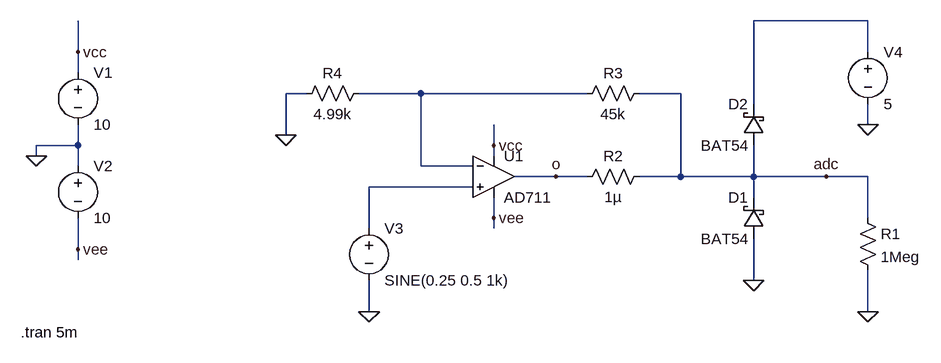
[diagram p0: schematic DAQ Device Op Amp Clamp Protection Mistake.asc]
DAQ Device Op Amp Clamp Protection Mistake.asc, the LTspice schematic file:
Version 4
SHEET 1 880 680
WIRE 672 -112 496 -112
WIRE -544 -64 -544 -112
WIRE 672 -64 672 -112
WIRE -544 -32 -544 -64
WIRE -192 0 -224 0
WIRE -16 0 -112 0
WIRE 240 0 -16 0
WIRE 384 0 320 0
WIRE 496 16 496 -112
WIRE 672 48 672 16
WIRE -224 64 -224 0
WIRE -544 80 -544 48
WIRE -544 80 -608 80
WIRE 96 80 96 48
WIRE -608 96 -608 80
WIRE 96 96 96 80
WIRE -544 112 -544 80
WIRE -16 112 -16 0
WIRE 64 112 -16 112
WIRE 192 128 128 128
WIRE 240 128 192 128
WIRE 384 128 384 0
WIRE 384 128 320 128
WIRE 496 128 496 80
WIRE 496 128 384 128
WIRE 608 128 496 128
WIRE 672 128 608 128
WIRE 64 144 -96 144
WIRE 496 160 496 128
WIRE 96 192 96 160
WIRE 672 192 672 128
WIRE -96 208 -96 144
WIRE 96 208 96 192
WIRE -544 240 -544 192
WIRE -544 256 -544 240
WIRE 496 288 496 224
WIRE -96 336 -96 288
WIRE 672 336 672 272
FLAG -608 96 0
FLAG -96 336 0
FLAG 672 336 0
FLAG -224 64 0
FLAG 96 80 vcc
FLAG -544 -64 vcc
FLAG -544 240 vee
FLAG 96 192 vee
FLAG 496 288 0
FLAG 672 48 0
FLAG 608 128 adc
FLAG 192 128 o
SYMBOL OpAmps\\AD711 96 64 R0
SYMATTR InstName U1
SYMBOL voltage -544 -48 R0
WINDOW 123 0 0 Left 0
WINDOW 39 0 0 Left 0
SYMATTR InstName V1
SYMATTR Value 10
SYMBOL voltage -544 96 R0
WINDOW 123 0 0 Left 0
WINDOW 39 0 0 Left 0
SYMATTR InstName V2
SYMATTR Value 10
SYMBOL voltage -96 192 R0
WINDOW 123 0 0 Left 0
WINDOW 39 0 0 Left 0
SYMATTR InstName V3
SYMATTR Value SINE(0.25 0.5 1k)
SYMBOL res 656 176 R0
SYMATTR InstName R1
SYMATTR Value 1Meg
SYMBOL res 336 112 R90
WINDOW 0 0 56 VBottom 2
WINDOW 3 32 56 VTop 2
SYMATTR InstName R2
SYMATTR Value 1µ
SYMBOL res 336 -16 R90
WINDOW 0 0 56 VBottom 2
WINDOW 3 32 56 VTop 2
SYMATTR InstName R3
SYMATTR Value 45k
SYMBOL res -96 -16 R90
WINDOW 0 0 56 VBottom 2
WINDOW 3 32 56 VTop 2
SYMATTR InstName R4
SYMATTR Value 4.99k
SYMBOL schottky 512 224 R180
WINDOW 0 24 64 Left 2
WINDOW 3 24 0 Left 2
SYMATTR InstName D1
SYMATTR Value BAT54
SYMATTR Description Diode
SYMATTR Type diode
SYMBOL schottky 512 80 R180
WINDOW 0 24 64 Left 2
WINDOW 3 24 0 Left 2
SYMATTR InstName D2
SYMATTR Value BAT54
SYMATTR Description Diode
SYMATTR Type diode
SYMBOL voltage 672 -80 R0
WINDOW 123 0 0 Left 0
WINDOW 39 0 0 Left 0
SYMATTR InstName V4
SYMATTR Value 5
TEXT -632 368 Left 2 !.tran 5m

The netlist it stands for:
* DAQ Device Op Amp Clamp Protection Mistake.asc
XU1 N003 N002 vcc vee o AD712  ; AD711, pins In+ In- V+ V- OUT
V1 vcc 0 10
V2 0 vee 10
V3 N003 0 SINE(0.25 0.5 1k)
R1 adc 0 1Meg
R2 adc o 1µ
R3 adc N002 45k
R4 N002 0 4.99k
D1 0 adc BAT54
D2 adc N001 BAT54
V4 N001 0 5
.model D D
.lib standard.dio
.tran 5m
.lib ADI1.lib
.backanno
.end